# EAGLE design MI0283QT_v15 (EAGLE 7.5.0)
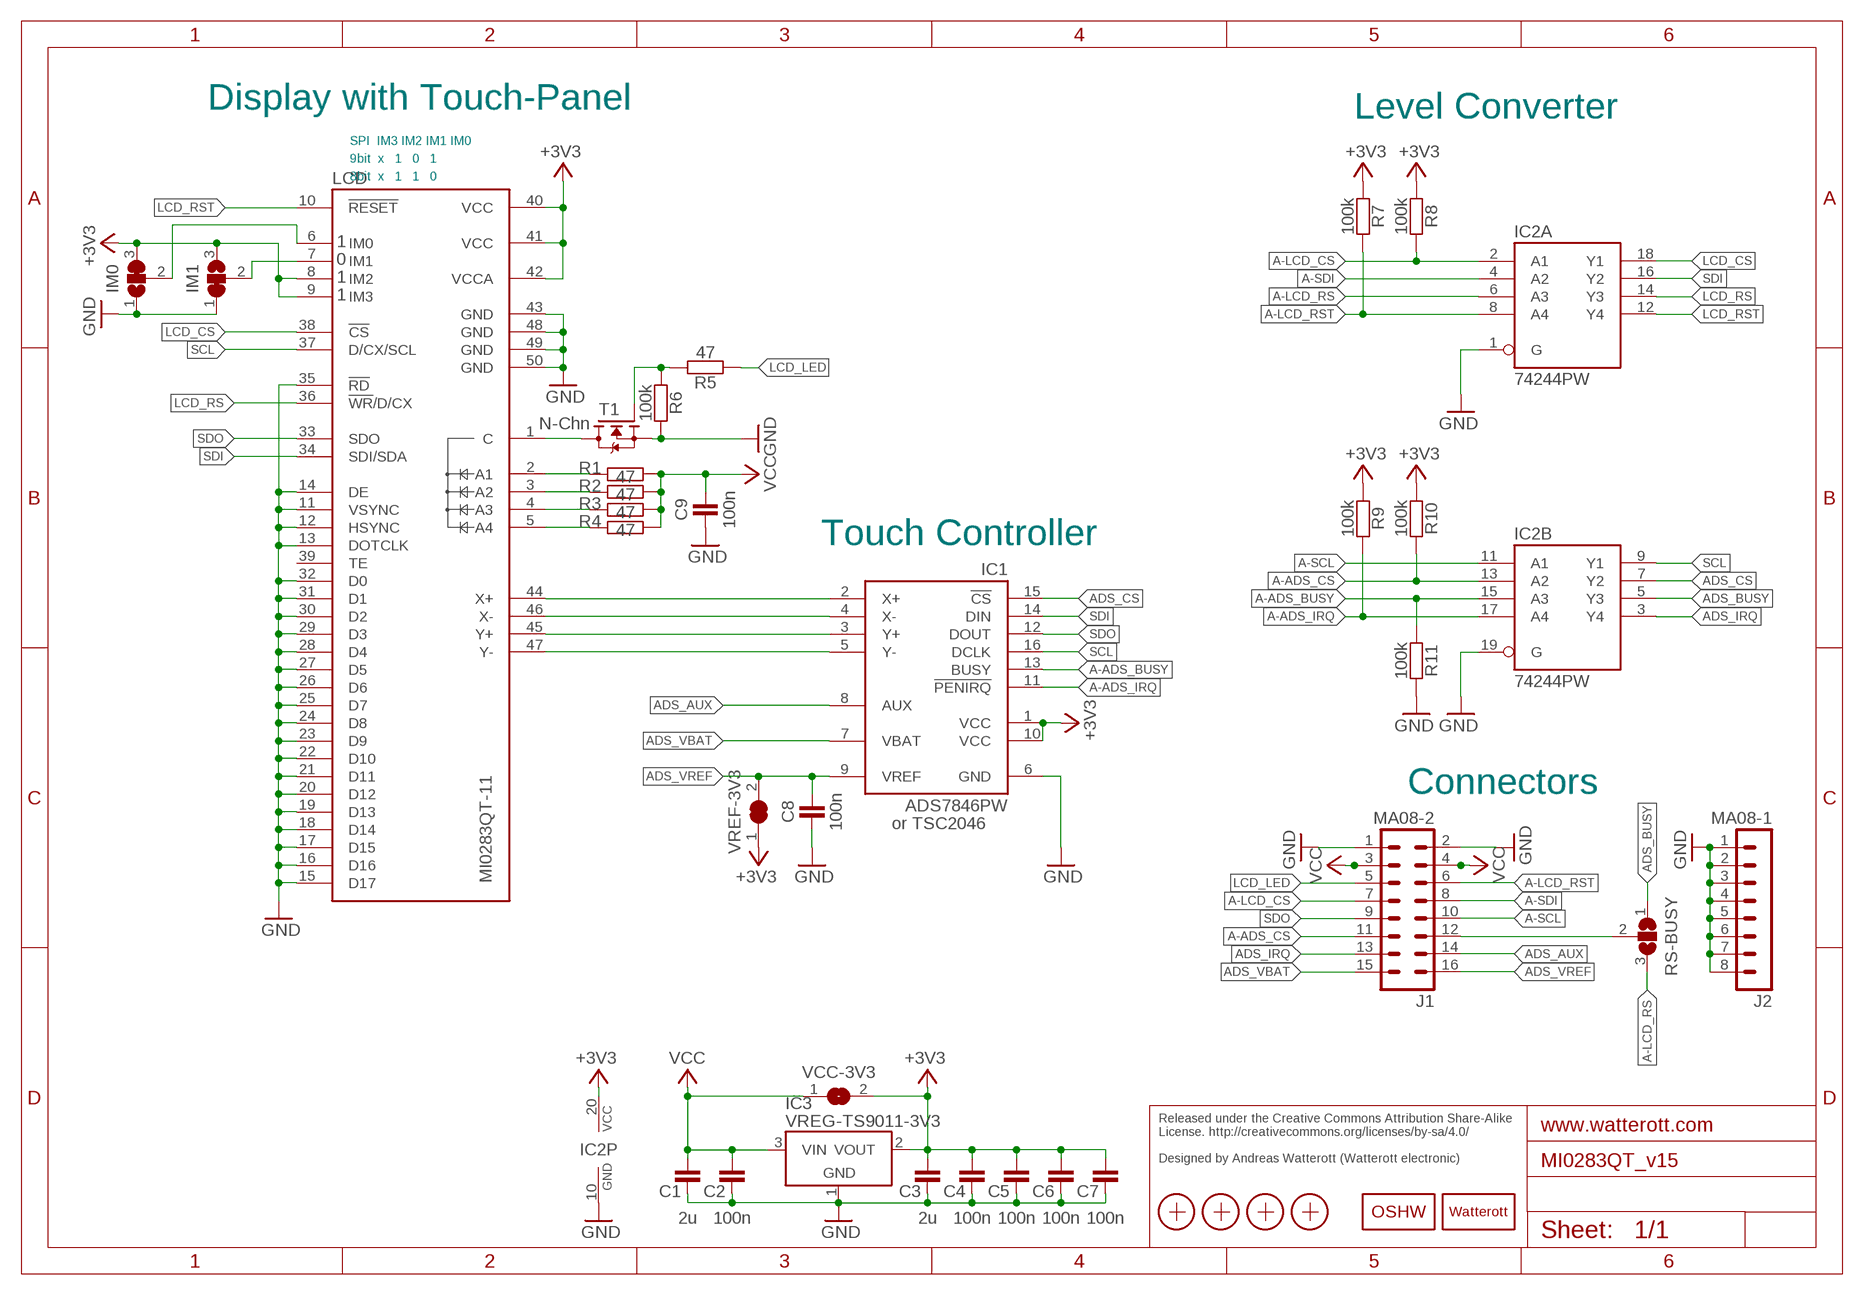
[diagram p0: schematic, sheet 1]

## Parts
C1  2u  CAPACITOR-0603  [C0603]
C2  100n  CAPACITOR-0402  [C0402]
C3  2u  CAPACITOR-0603  [C0603]
C4  100n  CAPACITOR-0402  [C0402]
C5  100n  CAPACITOR-0402  [C0402]
C6  100n  CAPACITOR-0402  [C0402]
C7  100n  CAPACITOR-0402  [C0402]
C8  100n  CAPACITOR-0402  [C0402]
C9  100n  CAPACITOR-0402  [C0402]
IC1  ADS7846PW  [TSSOP16]
IC2  74244PW  74LVC244PW  [TSSOP20]
IC3  VREG-TS9011-3V3  [SOT23]
IM0  JUMPER3-0603  [JUMPER3-0603]
IM1  JUMPER3-0603  [JUMPER3-0603]
J1  MA08-2  [MA08-2]
J2  MA08-1  [MA08-1]
LCD  MI0283QT-11  [MI0283QT11]
LOGO2  OSHW_LOGOX0150  [OSHW_6X150]
LOGO3  LOGO-PLACE  [LOGO_TPLACE]
R1  47  RESISTOR-0402  [C0402]
R2  47  RESISTOR-0402  [C0402]
R3  47  RESISTOR-0402  [C0402]
R4  47  RESISTOR-0402  [C0402]
R5  47  RESISTOR-0402  [C0402]
R6  100k  RESISTOR-0402  [C0402]
R7  100k  RESISTOR-0402  [C0402]
R8  100k  RESISTOR-0402  [C0402]
R9  100k  RESISTOR-0402  [C0402]
R10  100k  RESISTOR-0402  [C0402]
R11  100k  RESISTOR-0402  [C0402]
RS-BUSY  JUMPER3-0603  [JUMPER3-0603]
T1  N-Chn  MOSFET-N-SOT23  [SOT23]
VCC-3V3  JUMPER2-0603-NC  [JUMPER2-0603_NC]
VREF-3V3  JUMPER2-0603-NC  [JUMPER2-0603_NC]
X1  PASSER-07  [PASSER_07MM]
X2  PASSER-07  [PASSER_07MM]
X3  PASSER-07  [PASSER_07MM]
X4  PASSER-07  [PASSER_07MM]

## Nets
+3V3: C3.2 C4.2 C5.2 C6.2 C7.2 IC1.1(VCC) IC1.10(VCC) IC2.20(P:VCC) IC3.2(VOUT) IM0.3 IM1.3 LCD.8(IM2) LCD.9(IM3) LCD.40(VCC) LCD.41(VCC) LCD.42(VCCA) R7.1 R8.1 R9.1 R10.1 VCC-3V3.2 VREF-3V3.1
A-ADS_BUSY: IC1.13(BUSY) IC2.15(B:A3) R11.1
A-ADS_CS: IC2.13(B:A2) J1.11 R10.2
A-ADS_IRQ: IC1.11(!PENIRQ) IC2.17(B:A4) R9.2
A-LCD_CS: IC2.2(A:A1) J1.7 R8.2
A-LCD_RS: IC2.6(A:A3) RS-BUSY.3
A-LCD_RST: IC2.8(A:A4) J1.6 R7.2
A-SCL: IC2.11(B:A1) J1.10
A-SDI: IC2.4(A:A2) J1.8
ADS_AUX: IC1.8(AUX) J1.14
ADS_BUSY: IC2.5(B:Y3) RS-BUSY.1
ADS_CS: IC1.15(!CS) IC2.7(B:Y2)
ADS_IRQ: IC2.3(B:Y4) J1.13
ADS_VBAT: IC1.7(VBAT) J1.15
ADS_VREF: C8.2 IC1.9(VREF) J1.16 VREF-3V3.2
BUSY_RS: J1.12 RS-BUSY.2
C: LCD.1(C) T1.3(D)
GND: C1.1 C2.1 C3.1 C4.1 C5.1 C6.1 C7.1 C8.1 C9.1 IC1.6(GND) IC2.1(A:G) IC2.10(P:GND) IC2.19(B:G) IC3.1(GND) IM0.1 IM1.1 J1.1 J1.2 J2.1 J2.2 J2.3 J2.4 J2.5 J2.6 J2.7 J2.8 LCD.11(VSYNC) LCD.12(HSYNC) LCD.13(DOTCLK) LCD.14(DE) LCD.15(D17) LCD.16(D16) LCD.17(D15) LCD.18(D14) LCD.19(D13) LCD.20(D12) LCD.21(D11) LCD.22(D10) LCD.23(D9) LCD.24(D8) LCD.25(D7) LCD.26(D6) LCD.27(D5) LCD.28(D4) LCD.29(D3) LCD.30(D2) LCD.31(D1) LCD.32(D0) LCD.35(!RD) LCD.43(GND) LCD.48(GND) LCD.49(GND) LCD.50(GND) R6.2 R11.2 T1.2(S)
IM0: IM0.2 LCD.6(IM0)
LCD_CS: IC2.18(A:Y1) LCD.38(!CS)
LCD_LED: J1.5 R5.1
LCD_RS: IC2.14(A:Y3) LCD.36(!WR!/D/CX)
LCD_RST: IC2.12(A:Y4) LCD.10(!RESET)
LED_A1: LCD.2(A1) R1.2
LED_A2: LCD.3(A2) R2.2
LED_A3: LCD.4(A3) R3.2
LED_A4: LCD.5(A4) R4.2
LEDPWM: R5.2 R6.1 T1.1(G)
N$1: IC1.5(Y-) LCD.47(Y-)
N$2: IC1.3(Y+) LCD.45(Y+)
N$3: IC1.4(X-) LCD.46(X-)
N$4: IC1.2(X+) LCD.44(X+)
N$5: IM1.2 LCD.7(IM1)
SCL: IC1.16(DCLK) IC2.9(B:Y1) LCD.37(D/CX/SCL)
SDI: IC1.14(DIN) IC2.16(A:Y2) LCD.34(SDI/SDA)
SDO: IC1.12(DOUT) J1.9 LCD.33(SDO)
VCC: C1.2 C2.2 C9.2 IC3.3(VIN) J1.3 J1.4 R1.1 R2.1 R3.1 R4.1 VCC-3V3.1
Unconnected: LCD.39(TE)

## Notes on the sheet
- Display with Touch-Panel | Level Converter
- SPI  IM3 IM2 IM1 IM0
- 9bit  x   1   0   1
- 8bit  x   1   1   0
- 1
- 0
- 1
- 1
- Touch Controller
- Connectors
- or TSC2046
- Released under the Creative Commons Attribution Share-Alike 
  License. http://creativecommons.org/licenses/by-sa/4.0/
  
  Designed by Andreas Watterott (Watterott electronic)

## Library data of the parts
C1-C9 = we-rcl:CAPACITOR: Capacitors ...4.7uF @ 6.3V -> 0402 ...10uF @ 16V -> 0603 ...22uF @ 25V -> 0805
IC1 = we-chip:ADS7846: TI ADS7846 / TSC2046 Touch Screen Controller; DIGIKEY: TSC2046EIPWR-ND
IC2 = we-chip:74*244: 74x244 Octal Buffer and Line Driver (3-State); DIGIKEY: 568-1583-2-ND
IC3 = we-power:VREG: Voltage Regulators (LDOs, Switching Converters...) LDOs Taiwan Semi TS1117 800mA max 15V - compatible On Semi NCP1117 1A max 20V Taiwan Semi TS9011 250mA max 12V - compatible Diodes AP2210 300mA max 15V Taiwan Semi TS5204 150mA max 16V DC/DC Converter Modules Recom R-78Ex.x-1.0-W36 1A max 28V Murata OKI-78SR-x.x/1.5-W36 1.5A max 36V
IM0 IM1 RS-BUSY = we-rcl:JUMPER3: 3 Pin Jumpers
J1 = we-con:MA08-2: Pin Header
J2 = we-con:MA08-1: Pin Header
LCD = we-opto:MI0283QT: Multi-Inno MIO283QT-9/-11 2.8" Display (240x320) with Ilitek ILI9341 controller
LOGO2 = we-symbol:OSHW_LOGO: Open-Source-Hardware Logo
LOGO3 = we-symbol:LOGO: Watterott electronic Logo
R1-R11 = we-rcl:RESISTOR: Resistors all kinds in 0603 and 0402
T1 = we-transistor:MOSFET-N: N-Channel MOSFET (e.g. IRLML2502, BSS138)
VCC-3V3 VREF-3V3 = we-rcl:JUMPER2: 2 Pin Jumpers
X1-X4 = we-symbol:PASSER: Fiducial Markers

## Board
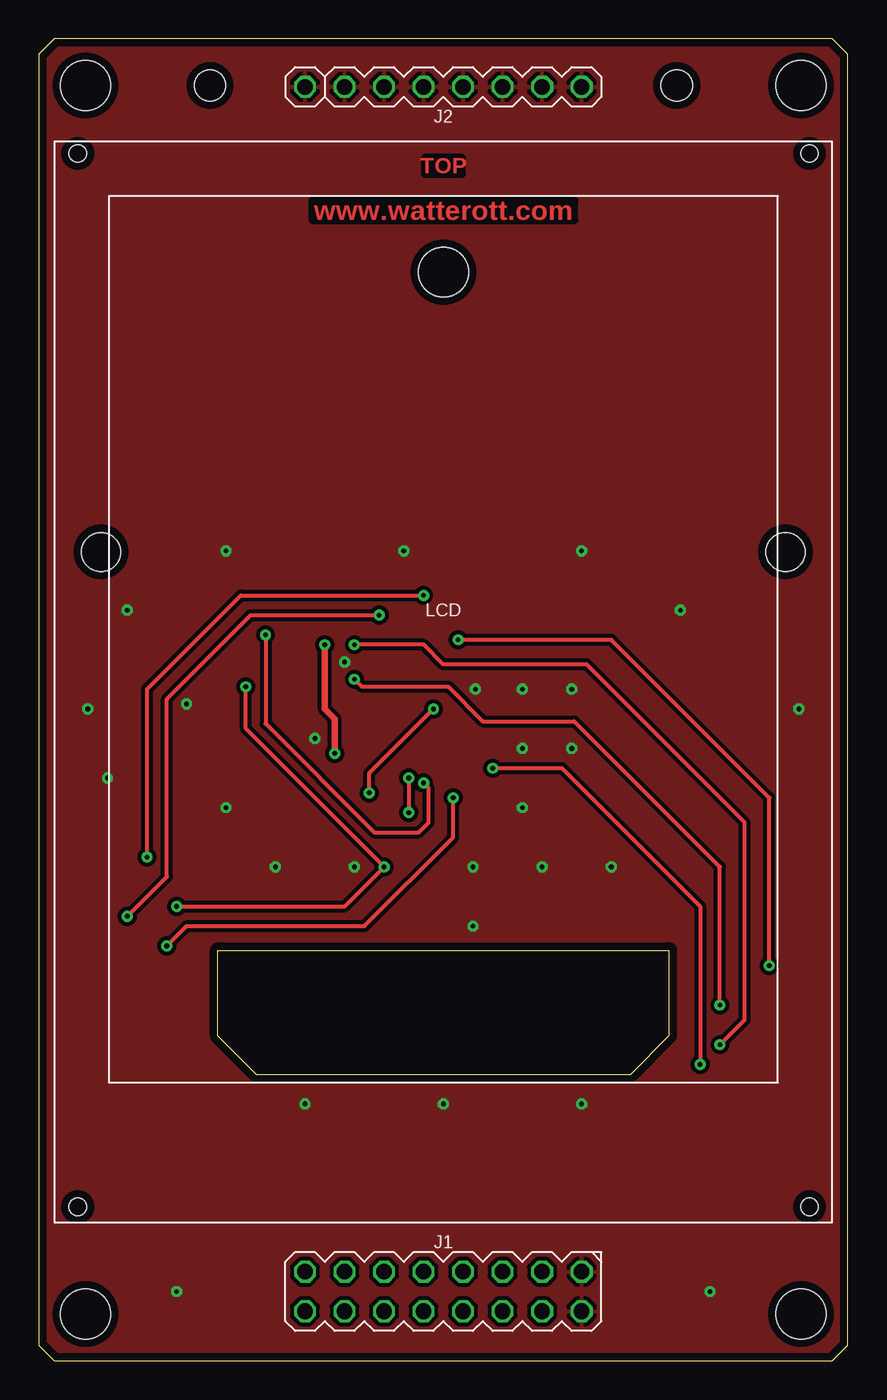
[diagram p1: board, top side]
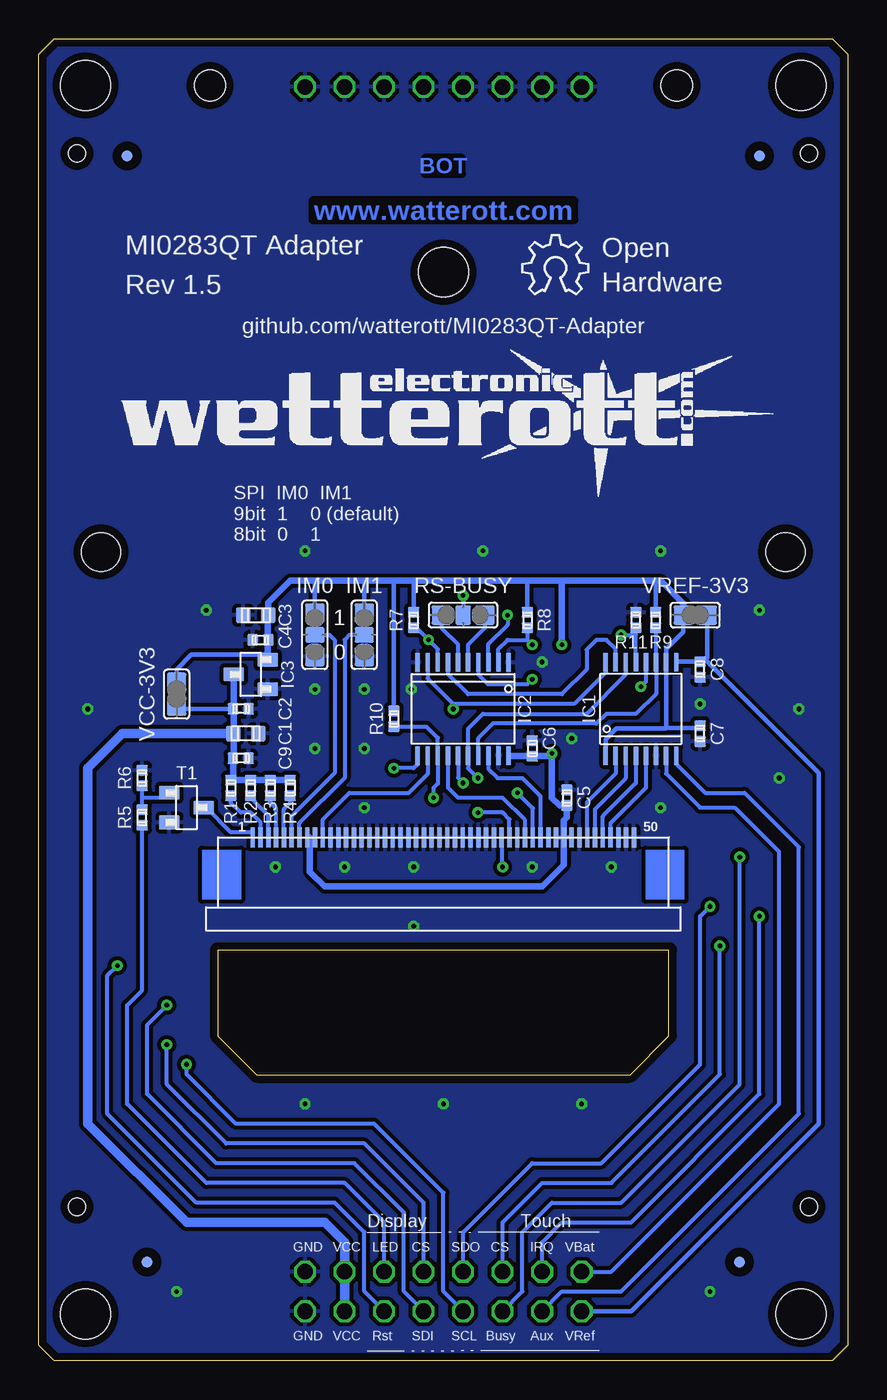
[diagram p2: board, bottom side, seen from below]

Size 52 x 85 mm. Coordinates in mm from the lower left corner, seen from the top.
Outline: 0,1 1,0 51,0 52,1 52,84 51,85 1,85 0,84 0,1
Copper layers (1*16): Top 0.035mm / dielectric 1.5mm / Bottom 0.035mm
Design rules "we-dru": minimum track width 0.15mm, minimum drill 0.3mm, track to track 0.15mm, track to pad 0.15mm, pad to pad 0.15mm, via to via 0.15mm, smd to smd 0.1mm, copper to edge 0.5mm, drill to drill 0.2mm, minimum pad ring 0.18mm, minimum via ring 0.2mm, stop-mask expansion 0.1mm, vias tented up to drill 0.5mm, thermal gap 0.25mm
Holes 3.2 mm at 3,3 49,3 3,82 49,82 26,70
Holes 2 mm at 41,82 11,82
Holes 2.5 mm at 4,52 48,52

### Footprints (pad centres in the part's own frame; a part is rotated, then mirrored left to right if it is on the bottom)
C0603 = smd 1 x 0.95: 1 0,0.8; 2 0,-0.8
C0402 = smd 0.75 x 0.7: 1 0,0.5; 2 0,-0.5
TSSOP16 = smd 1.2 x 0.35: 1 -3,2.275; 2 -3,1.625; 3 -3,0.975; 4 -3,0.325; 5 -3,-0.325; 6 -3,-0.975; 7 -3,-1.625; 8 -3,-2.275; 9 3,-2.275; 10 3,-1.625; 11 3,-0.975; 12 3,-0.325; 13 3,0.325; 14 3,0.975; 15 3,1.625; 16 3,2.275
TSSOP20 = smd 1.2 x 0.35: 1 -3,2.925; 2 -3,2.275; 3 -3,1.625; 4 -3,0.975; 5 -3,0.325; 6 -3,-0.325; 7 -3,-0.975; 8 -3,-1.625; 9 -3,-2.275; 10 -3,-2.925; 11 3,-2.925; 12 3,-2.275; 13 3,-1.625; 14 3,-0.975; 15 3,-0.325; 16 3,0.325; 17 3,0.975; 18 3,1.625; 19 3,2.275; 20 3,2.925
SOT23 = smd 1.3 x 0.9: 1 -1.1,0.95; 2 -1.1,-0.95; 3 1.1,0
JUMPER3-0603 = smd 1.25 x 1.25: 1 0,1.4; 3 0,-1.4 | smd 1.25 x 1: 2 0,0
MA08-2 = drill 1 octagon: 1 -1.27,8.89; 2 1.27,8.89; 3 -1.27,6.35; 4 1.27,6.35; 5 -1.27,3.81; 6 1.27,3.81; 7 -1.27,1.27; 8 1.27,1.27; 9 -1.27,-1.27; 10 1.27,-1.27; 11 -1.27,-3.81; 12 1.27,-3.81; 13 -1.27,-6.35; 14 1.27,-6.35; 15 -1.27,-8.89; 16 1.27,-8.89
MA08-1 = drill 1 octagon: 1 0,8.89; 2 0,6.35; 3 0,3.81; 4 0,1.27; 5 0,-1.27; 6 0,-3.81; 7 0,-6.35; 8 0,-8.89
MI0283QT11 = smd 0.279 x 1.27 bottom: 1 12.25,24.762; 2 11.75,24.762; 3 11.25,24.762; 4 10.75,24.762; 5 10.25,24.762; 6 9.75,24.762; 7 9.25,24.762; 8 8.75,24.762; 9 8.25,24.762; 10 7.75,24.762; 11 7.25,24.762; 12 6.75,24.762; 13 6.25,24.762; 14 5.75,24.762; 15 5.25,24.762; 16 4.75,24.762; 17 4.25,24.762; 18 3.75,24.762; 19 3.25,24.762; 20 2.75,24.762; 21 2.25,24.762; 22 1.75,24.762; 23 1.25,24.762; 24 0.75,24.762; 25 0.25,24.762; 26 -0.25,24.762; 27 -0.75,24.762; 28 -1.25,24.762; 29 -1.75,24.762; 30 -2.25,24.762; 31 -2.75,24.762; 32 -3.25,24.762; 33 -3.75,24.762; 34 -4.25,24.762; 35 -4.75,24.762; 36 -5.25,24.762; 37 -5.75,24.762; 38 -6.25,24.762; 39 -6.75,24.762; 40 -7.25,24.762; 41 -7.75,24.762; 42 -8.25,24.762; 43 -8.75,24.762; 44 -9.25,24.762; 45 -9.75,24.762; 46 -10.25,24.762; 47 -10.75,24.762; 48 -11.25,24.762; 49 -11.75,24.762; 50 -12.25,24.762 | hole 1.1: 23.54,1; -23.5,1; 23.54,68.75; -23.5,68.75
JUMPER2-0603_NC = smd 1.25 x 1.25: 1 0,0.76; 2 0,-0.76
PASSER_07MM = smd 0.7 x 0.7: X 0,0

### Placement (x,y rotation side)
C1  38.7,40.32 270 bottom
C2  39.02,41.91 270 bottom
C3  38.06,47.94 90 bottom
C4  37.75,46.35 90 bottom
C5  18.06,36.2 0 bottom
C6  20.29,39.37 0 bottom
C7  9.49,40.32 180 bottom
C8  9.49,44.45 180 bottom
C9  39.02,38.73 270 bottom
IC1  13.3,41.91 90 bottom
IC2  24.73,41.91 270 bottom
IC3  38.38,44.13 180 bottom
IM0  34.26,46.67 180 bottom
IM1  31.08,46.67 180 bottom
J1  26,4.45 270 top
J2  26,81.92 90 top
LCD  26,8.89 0 top
LOGO2  20.92,68.58 0 bottom
LOGO3  46.95,55.24 0 bottom
R1  39.65,36.83 0 bottom
R2  38.38,36.83 0 bottom
R3  37.11,36.83 0 bottom
R4  35.84,36.83 0 bottom
R5  45.37,34.92 180 bottom
R6  45.37,37.47 180 bottom
R7  27.91,47.62 0 bottom
R8  20.6,47.62 0 bottom
R9  12.35,47.62 0 bottom
R10  29.18,41.27 0 bottom
R11  13.62,47.62 180 bottom
RS-BUSY  24.73,47.94 270 bottom
T1  42.51,35.56 0 bottom
VCC-3V3  43.14,42.86 180 bottom
VREF-3V3  9.81,47.94 90 bottom
X1  6.95,6.35 0 bottom
X2  5.68,77.47 0 bottom
X3  46.32,77.47 0 bottom
X4  45.05,6.35 0 bottom

### Tracks (layer width: path | path; a pad name or v marks a point on that pad's centre or on a via)
+3V3  (via drill 0.3)
  Top 0.406: v19.02,39.05 19.02,41.27 18.38,41.91 v18.38,46.04
  Bottom 0.254: C3.2 37.27,48.26 37.28,48.24 | 11.68,40.68 11.71,40.64 | C4.2 37.28,46.35 | LCD.42 LCD.41 LCD.40 | LCD.8 LCD.9 34.57,33.66 | 21.77,38.87 IC2.20
  Bottom 0.305: R9.1 12.35,50.16 | IC1.1 15.57,39.95 14.89,40.64 11.71,40.64 | VREF-3V3.1 10.57,46.87 11.68,45.76 IC1.10 11.68,40.68 9.64,40.68 C7.2 | 37.43,45.4 42.19,45.4 43.14,44.45 VCC-3V3.2 | R8.1 20.6,50.16 | IM0.3 34.26,50.16 | R7.1 27.91,50.16 | IM1.3 31.08,50.16 | R10.1 29.18,50.16
  Bottom 0.406: 37.27,48.26 37.27,48.74 35.84,50.16 34.26,50.16 31.08,50.16 29.18,50.16 27.91,50.16 20.6,50.16 18.38,50.16 | 18.38,50.16 12.35,50.16 12.03,50.16 10.57,48.7 VREF-3V3.1 | 37.28,48.24 37.28,46.35 IC3.2 37.28,45.26 37.43,45.4 | 34.57,33.66 34.57,31.43 33.62,30.48 19.65,30.48 18.25,31.88 LCD.41 18.25,34.74 18.06,34.92 C5.2 18.52,35.7 19.02,36.2 v19.02,39.05 19.2,38.87 C6.2 21.77,38.87 | v18.38,46.04 18.38,50.16
A-ADS_BUSY  (via drill 0.3)
  Top 0.254: v14.57,46.67 14.57,40.96 21.55,33.97 24.41,33.97 25.05,34.61 25.05,36.83 v24.73,37.15
  Bottom 0.254: IC1.13 13.62,46.67 | 13.62,46.67 R11.1 | v14.57,46.67 13.62,46.67 | IC2.15 25.05,37.47 v24.73,37.15
A-ADS_CS  (via drill 0.3)
  Top 0.254: v8.22,26.67 9.49,27.94 20.92,27.94 26.64,33.66 v26.64,36.2
  Bottom 0.254: J1.11 22.19,8.89 19.65,11.43 15.21,11.43 8.22,18.41 v8.22,26.67 | R10.2 27.09,40.77 26.36,40.04 IC2.13 26.36,37.11 26.64,36.83 v26.64,36.2
A-ADS_IRQ
  Bottom 0.254: R9.2 12.32,47.1 IC1.11 12.32,42.88 13.62,41.59 15.52,41.59 16.16,40.96 22.82,40.96 23.75,40.03 IC2.17
A-LCD_CS  (via drill 0.3)
  Top 0.254: v43.78,20.32 45.37,21.91 45.37,34.61 35.21,44.77 26,44.77 24.73,46.04 v20.29,46.04
  Bottom 0.254: J1.7 27.27,10.16 31.08,13.97 39.97,13.97 43.78,17.78 v43.78,20.32 | R8.2 20.6,46.35 | 20.6,46.35 v20.29,46.04 | IC2.2 22.45,45.77 21.87,46.35 20.6,46.35
A-LCD_RS
  Bottom 0.254: RS-BUSY.3 26.13,47.12 25.05,46.05 IC2.6
A-LCD_RST  (via drill 0.3)
  Top 0.254: v46.95,25.4 46.95,36.2 36.8,46.35 v26.95,46.35
  Bottom 0.254: J1.6 31.08,4.45 31.08,8.26 32.98,10.16 41.88,10.16 47.59,15.88 47.59,24.77 v46.95,25.4 | R7.2 27.77,46.99 27.59,46.99 v26.95,46.35 26.36,45.76 IC2.8
A-SCL  (via drill 0.3)
  Top 0.254: v29.18,38.1 33.62,38.1 42.51,29.21 v42.51,19.05
  Bottom 0.254: J1.10 26,4.45 26,10.79 30.45,15.24 39.34,15.24 42.51,18.41 v42.51,19.05 | IC2.11 27.66,38.35 27.91,38.1 v29.18,38.1
A-SDI  (via drill 0.3)
  Top 0.254: v43.78,22.86 43.78,31.75 34.41,41.12 28.54,41.12 26.32,43.34 20.76,43.34 v20.29,43.81
  Bottom 0.254: J1.8 28.54,4.45 28.54,9.53 31.71,12.7 40.61,12.7 45.05,17.14 45.05,21.59 v43.78,22.86 | IC2.4 23.75,44.11 23.14,43.5 20.6,43.5 v20.29,43.81
ADS_AUX
  Bottom 0.254: J1.14 18.38,4.45 14.57,4.45 3.14,15.88 3.14,33.02 6.63,36.51 9.17,36.51 11.03,38.37 IC1.8
ADS_BUSY
  Bottom 0.254: IC2.5 24.41,46.05 23.33,47.12 RS-BUSY.1
ADS_CS
  Bottom 0.254: IC1.15 14.93,45.76 15.52,46.35 16.16,46.35 16.79,45.72 16.79,44.45 18.38,42.86 24.41,42.86 25.7,44.16 IC2.7
ADS_IRQ  (via drill 0.3)
  Top 0.254: v5.68,28.57 8.22,31.11 8.22,42.55 13.62,47.94 v21.87,47.94
  Bottom 0.254: J1.13 19.65,7.62 18.38,8.89 13.94,8.89 5.68,17.14 v5.68,28.57 | IC2.3 23.11,46.08 21.87,47.31 v21.87,47.94
ADS_VBAT
  Bottom 0.254: J1.15 15.21,5.71 4.41,16.51 4.41,32.7 7.27,35.56 9.49,35.56 11.68,37.74 IC1.7
ADS_VREF
  Bottom 0.254: 10.98,44.95 IC1.9
  Bottom 0.305: J1.16 13.94,3.17 1.87,15.24 1.87,37.78 9.17,45.09 | VREF-3V3.2 9.05,45.21 9.17,45.09 | 9.17,45.09 9.31,44.95 C8.2 10.98,44.95
BUSY_RS  (via drill 0.3)
  Top 0.254: v6.95,32.38 6.95,43.18 12.98,49.21 v24.73,49.21
  Bottom 0.254: J1.12 20.92,4.45 20.92,8.26 19.02,10.16 14.57,10.16 6.95,17.78 v6.95,32.38 | v24.73,49.21 RS-BUSY.2
C
  Bottom 0.254: LCD.1 38.25,33.84 38.38,33.97 39.65,33.97 41.24,35.56 T1.3
GND  (via drill 0.3)
  other vias: 34.89,16.51 43.14,4.45 8.86,4.45 17.11,16.51 15.21,31.75 20.29,31.75 27.91,31.75 32.35,31.75 36.8,31.75 31.08,43.18 34.26,43.18 28.06,43.18 19.65,44.93 9.49,42.23 17.74,40.01 12.03,35.56 31.08,35.56 34.26,39.37 41.24,48.26 5.68,48.26 34.89,52.07 23.46,52.07 12.03,52.07 4.41,37.47 31.08,39.37 26,16.51 3.14,41.91 48.86,41.91 27.91,27.94
  pour Bottom (isolate 0.254): 0,85 52,85 52,0 0,0
  pour Top (isolate 0.254): 0,85 52,85 52,0 0,0
IM0
  Bottom 0.254: LCD.6 35.75,35.02 34.1,36.67 33.94,36.83 32.98,37.78 32.98,46.35 33.3,46.67 IM0.2
LCD_CS
  Bottom 0.254: LCD.38 19.75,36.3 20.92,37.47 22.51,37.47 23.11,38.06 IC2.18
LCD_LED
  Bottom 0.254: J1.5 29.81,8.89 32.35,11.43 41.24,11.43 46.32,16.51 46.32,22.86 45.37,23.81 R5.1
LCD_RS
  Bottom 0.254: LCD.36 20.75,34.76 22.19,36.2 25.05,36.2 25.7,36.85 IC2.14
LCD_RST
  Bottom 0.254: LCD.10 33.75,34.8 32.03,36.51 28.22,36.51 27,37.73 IC2.12
LED_A1
  Bottom 0.254: LCD.2 37.75,34.61 38.38,35.24 39.02,35.24 39.65,35.88 R1.2
LED_A2
  Bottom 0.254: LCD.3 37.25,35.06 38.38,36.2 R2.2
LED_A3
  Bottom 0.254: LCD.4 36.75,35.52 37.11,35.88 R3.2
LED_A4
  Bottom 0.254: LCD.5 36.25,35.47 35.84,35.88 R4.2
LEDPWM
  Bottom 0.254: R5.2 45.37,36.2 | 45.37,36.2 R6.1 | T1.1 43.61,36.37 43.78,36.2 45.37,36.2
N$1
  Bottom 0.254: LCD.47 15.25,34.56 12.97,36.84 IC1.5
N$2
  Bottom 0.254: IC1.3 14.28,37.44 16.25,35.47 LCD.45
N$3
  Bottom 0.254: IC1.4 13.62,37.14 15.75,35.02 LCD.46
N$4
  Bottom 0.254: IC1.2 14.93,37.74 16.75,35.92 LCD.44
N$5
  Bottom 0.254: LCD.7 35.25,34.56 32.35,37.47 32.35,46.35 32.03,46.67 IM1.2
N$7
  Bottom 0.254: 9.33,47.94 10.28,47.94
SCL  (via drill 0.3)
  Top 0.254: v21.24,36.51 21.24,37.78 v25.36,41.91
  Bottom 0.254: IC1.16 15.57,44.24 17.59,42.23 25.36,42.23 | v25.36,41.91 25.36,42.23 | 25.36,42.23 27,43.87 IC2.9 | LCD.37 20.25,35.52 v21.24,36.51
SDI  (via drill 0.3)
  Top 0.254: v23.78,37.47 v23.78,35.24
  Bottom 0.254: IC1.14 14.28,44.11 16.79,41.59 23.46,41.59 24.41,40.65 IC2.16 24.41,38.09 v23.78,37.47 | LCD.34 21.75,34.8 22.19,35.24 v23.78,35.24
SDO  (via drill 0.3)
  Top 0.254: v8.86,29.21 19.65,29.21 v22.19,31.75 13.3,40.64 v13.3,43.34
  Bottom 0.254: J1.9 24.73,8.26 20.29,12.7 15.84,12.7 9.49,19.05 9.49,28.57 v8.86,29.21 | IC1.12 12.97,43.66 v13.3,43.34 | LCD.33 22.25,31.81 v22.19,31.75
VCC
  Bottom 0.254: 39.48,38.77 C9.2 | C1.2 39.48,40.32 | C2.2 39.48,41.91 | 39.52,37.51 39.34,37.33
  Bottom 0.305: C2.2 43.14,41.91 VCC-3V3.1
  Bottom 0.406: R4.1 R3.1 R2.1 39.34,37.33 R1.1 | IC3.3 39.48,41.91 39.48,40.32 39.48,38.77 | C9.2 39.52,37.51
  Bottom 0.61: J1.4 J1.3 32.35,7.62 33.62,8.89 42.51,8.89 48.86,15.24 48.86,38.1 46.64,40.32 C1.2

### Text on the board
Top: TOP | www.watterott.com
Bottom: BOT | www.watterott.com
bPlace: Open | MI0283QT Adapter | Hardware | Rev 1.5 | github.com/watterott/MI0283QT-Adapter | SPI IM0 IM1 / 9bit 1 0 (default) / 8bit 0 1 | 1 | 0 | Touch | Display | VBat | IRQ | CS | SDO | CS | LED | VCC | GND | VRef | Aux | Busy | SCL | SDI | Rst | VCC | GND
Reference: Silkscreen: 22 bPlace + 26 bNames